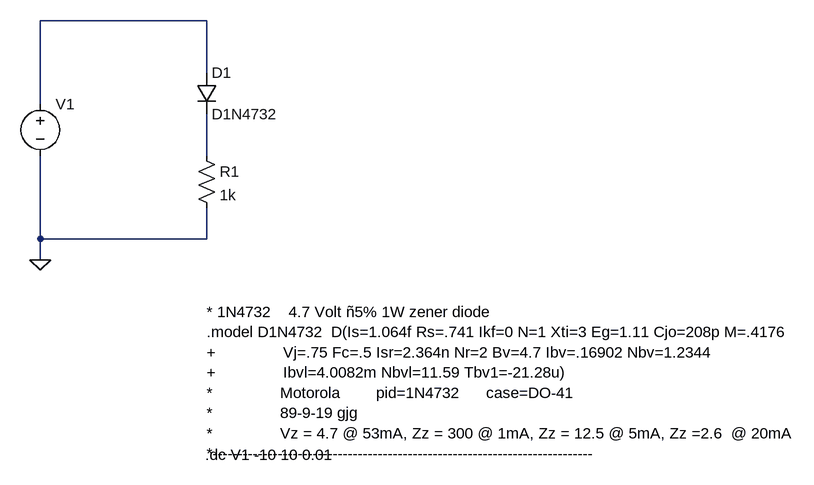
[diagram p0: schematic 1n4732_sample.asc]
1n4732_sample.asc, the LTspice schematic file:
Version 4
SHEET 1 1176 680
WIRE 176 -64 -80 -64
WIRE 176 16 176 -64
WIRE -80 64 -80 -64
WIRE 176 144 176 80
WIRE -80 272 -80 144
WIRE 176 272 176 224
WIRE 176 272 -80 272
WIRE -80 304 -80 272
FLAG -80 304 0
SYMBOL diode 160 16 R0
SYMATTR InstName D1
SYMATTR Value D1N4732
SYMBOL res 160 128 R0
SYMATTR InstName R1
SYMATTR Value 1k
SYMBOL voltage -80 48 R0
WINDOW 123 0 0 Left 0
WINDOW 39 0 0 Left 0
SYMATTR InstName V1
SYMATTR Value ""
TEXT 176 384 Left 2 !* 1N4732    4.7 Volt ñ5% 1W zener diode\n.model D1N4732  D(Is=1.064f Rs=.741 Ikf=0 N=1 Xti=3 Eg=1.11 Cjo=208p M=.4176\n+               Vj=.75 Fc=.5 Isr=2.364n Nr=2 Bv=4.7 Ibv=.16902 Nbv=1.2344\n+               Ibvl=4.0082m Nbvl=11.59 Tbv1=-21.28u)\n*               Motorola        pid=1N4732      case=DO-41\n*               89-9-19 gjg\n*               Vz = 4.7 @ 53mA, Zz = 300 @ 1mA, Zz = 12.5 @ 5mA, Zz =2.6  @ 20mA\n*----------------------------------------------------------------------------
TEXT 174 604 Left 2 !.dc V1 -10 10 0.01

The netlist it stands for:
* 1n4732_sample.asc
D1 N001 N002 D1N4732
R1 N002 0 1k
V1 N001 0
.model D D
.lib standard.dio
* 1N4732    4.7 Volt ñ5% 1W zener diode
.model D1N4732  D(Is=1.064f Rs=.741 Ikf=0 N=1 Xti=3 Eg=1.11 Cjo=208p M=.4176
+               Vj=.75 Fc=.5 Isr=2.364n Nr=2 Bv=4.7 Ibv=.16902 Nbv=1.2344
+               Ibvl=4.0082m Nbvl=11.59 Tbv1=-21.28u)
*               Motorola        pid=1N4732      case=DO-41
*               89-9-19 gjg
*               Vz = 4.7 @ 53mA, Zz = 300 @ 1mA, Zz = 12.5 @ 5mA, Zz =2.6  @ 20mA
*----------------------------------------------------------------------------
.dc V1 -10 10 0.01
.backanno
.end